# Altium schematic sheet ADC_8CH.SchDoc: FMC_ADC
size 420 x 297 mm; Author: G.Kasprowicz; CompanyName: WUT ISE; DrawnBy: G.Kasprowicz; Organization: WUT ISE; Address1: PW ISE; Address2: Nowowiejska 15/19 00-665 Warsaw; Address3: gkasprow@gmail.com; DocumentNumber: 5; Revision: 2; SheetNumber: 5; SheetTotal: 12; ModifiedBy: -; CheckedDate: -; Title2: ADC; DivGrp: WUT ISE; Designer: G.Kasprowicz; ModifiedDate: -; ProjectName: Sensor Box
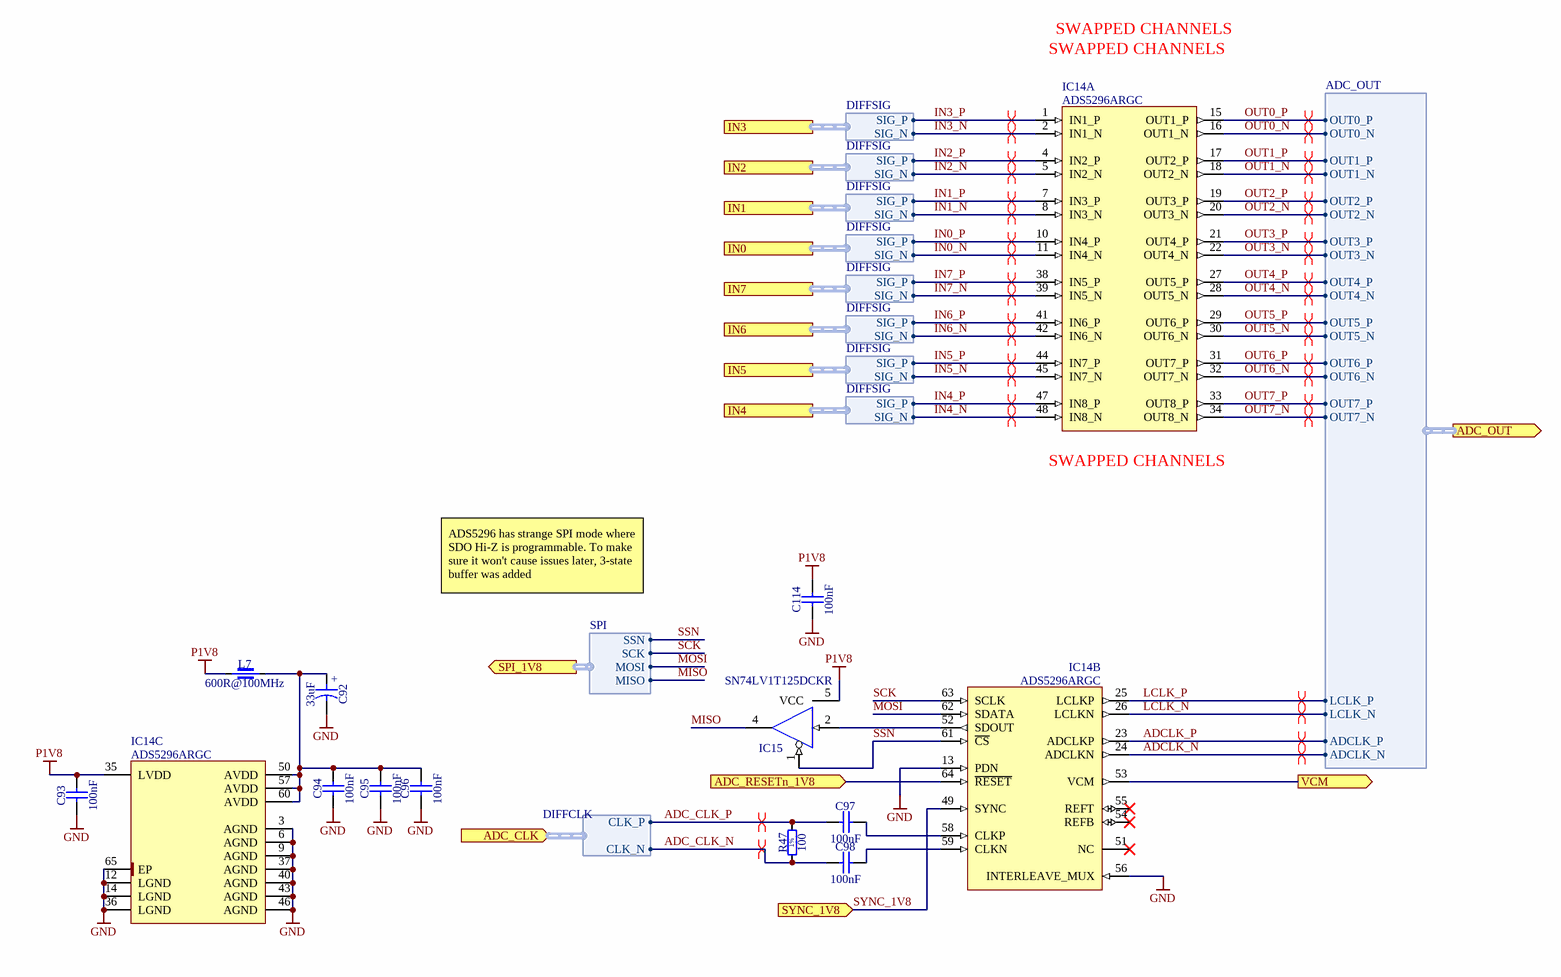
[diagram p0: ADC_8CH.SchDoc]

## Parts
C92  33uF  [CAPMP3216X180N]
C93  100nF  [CAPC0603X33N]
C94  100nF  [CAPC0603X33N]
C95  100nF  [CAPC0603X33N]
C96  100nF  [CAPC0603X33N]
C97  100nF  [CAPC0603X33N]
C98  100nF  [CAPC0603X33N]
C114  100nF  [CAPC0603X33N]
IC14  ADS5296ARGC  [QFN50P900X900X100-65N-S735]  (parts A,B,C of 3)
IC15  SN74LV1T125DCKR  [SOT65P210X110-5N]
L7  600R@100MHz  [INDC1005X55N]
R47  100  [RESC0603X28N]

## Ports
ADC_CLK (in, harness DIFFCLK), ADC_OUT (out, harness ADC_OUT), ADC_RESETn_1V8 (in), IN0 (harness DIFFSIG), IN1 (harness DIFFSIG), IN2 (harness DIFFSIG), IN3 (harness DIFFSIG), IN4 (harness DIFFSIG), IN5 (harness DIFFSIG), IN6 (harness DIFFSIG), IN7 (harness DIFFSIG), SPI_1V8 (out, harness SPI), SYNC_1V8 (in), VCM (out)

## Harnesses
ADC_OUT: LCLK_P, LCLK_N, ADCLK_P, ADCLK_N, OUT1_N, OUT2_N, OUT3_N, OUT4_N, OUT5_N, OUT1_P, OUT2_P, OUT3_P, OUT4_P, OUT5_P, OUT0_P, OUT0_N, OUT6_P, OUT6_N, OUT7_P, OUT7_N
SPI: MISO, MOSI, SCK, SSN
DIFFCLK: CLK_P, CLK_N
DIFFSIG: SIG_P, SIG_N

## Nets
GND: C92.2 C93.1 C94.1 C95.1 C96.1 C114.1 IC14.3(AGND) IC14.6(AGND) IC14.9(AGND) IC14.12(LGND) IC14.13(PDN) IC14.14(LGND) IC14.36(LGND) IC14.37(AGND) IC14.40(AGND) IC14.43(AGND) IC14.46(AGND) IC14.56(INTERLEAVE_MUX) IC14.65(EP) IC15.3(GND)
P1V8: C93.2 C114.2 IC14.35(LVDD) IC15.5(VCC) L7.1
ADC_CLK_N: C98.1 R47.1 ; port ADC_CLK.CLK_N
ADC_CLK_P: C97.1 R47.2 ; port ADC_CLK.CLK_P
ADC_RESETn_1V8: IC14.64(~{RESET}) ; port ADC_RESETn_1V8
ADCLK_N: IC14.24(ADCLKN) ; port ADC_OUT.ADCLK_N
ADCLK_P: IC14.23(ADCLKP) ; port ADC_OUT.ADCLK_P
IN0_N: IC14.11(IN4_N) ; port IN0.SIG_N
IN0_P: IC14.10(IN4_P) ; port IN0.SIG_P
IN1_N: IC14.8(IN3_N) ; port IN1.SIG_N
IN1_P: IC14.7(IN3_P) ; port IN1.SIG_P
IN2_N: IC14.5(IN2_N) ; port IN2.SIG_N
IN2_P: IC14.4(IN2_P) ; port IN2.SIG_P
IN3_N: IC14.2(IN1_N) ; port IN3.SIG_N
IN3_P: IC14.1(IN1_P) ; port IN3.SIG_P
IN4_N: IC14.48(IN8_N) ; port IN4.SIG_N
IN4_P: IC14.47(IN8_P) ; port IN4.SIG_P
IN5_N: IC14.45(IN7_N) ; port IN5.SIG_N
IN5_P: IC14.44(IN7_P) ; port IN5.SIG_P
IN6_N: IC14.42(IN6_N) ; port IN6.SIG_N
IN6_P: IC14.41(IN6_P) ; port IN6.SIG_P
IN7_N: IC14.39(IN5_N) ; port IN7.SIG_N
IN7_P: IC14.38(IN5_P) ; port IN7.SIG_P
LCLK_N: IC14.26(LCLKN) ; port ADC_OUT.LCLK_N
LCLK_P: IC14.25(LCLKP) ; port ADC_OUT.LCLK_P
MISO: IC15.4(OUT) ; port SPI_1V8.MISO
MOSI: IC14.62(SDATA) ; port SPI_1V8.MOSI
OUT0_N: IC14.16(OUT1_N) ; port ADC_OUT.OUT0_N
OUT0_P: IC14.15(OUT1_P) ; port ADC_OUT.OUT0_P
OUT1_N: IC14.18(OUT2_N) ; port ADC_OUT.OUT1_N
OUT1_P: IC14.17(OUT2_P) ; port ADC_OUT.OUT1_P
OUT2_N: IC14.20(OUT3_N) ; port ADC_OUT.OUT2_N
OUT2_P: IC14.19(OUT3_P) ; port ADC_OUT.OUT2_P
OUT3_N: IC14.22(OUT4_N) ; port ADC_OUT.OUT3_N
OUT3_P: IC14.21(OUT4_P) ; port ADC_OUT.OUT3_P
OUT4_N: IC14.28(OUT5_N) ; port ADC_OUT.OUT4_N
OUT4_P: IC14.27(OUT5_P) ; port ADC_OUT.OUT4_P
OUT5_N: IC14.30(OUT6_N) ; port ADC_OUT.OUT5_N
OUT5_P: IC14.29(OUT6_P) ; port ADC_OUT.OUT5_P
OUT6_N: IC14.32(OUT7_N) ; port ADC_OUT.OUT6_N
OUT6_P: IC14.31(OUT7_P) ; port ADC_OUT.OUT6_P
OUT7_N: IC14.34(OUT8_N) ; port ADC_OUT.OUT7_N
OUT7_P: IC14.33(OUT8_P) ; port ADC_OUT.OUT7_P
SCK: IC14.63(SCLK) ; port SPI_1V8.SCK
SSN: IC14.61(~{CS}) IC15.1(~{G}) ; port SPI_1V8.SSN
SYNC_1V8: IC14.49(SYNC) ; port SYNC_1V8
VCM: IC14.53(VCM) ; port VCM
NetC92_1: C92.1 C94.2 C95.2 C96.2 IC14.50(AVDD) IC14.57(AVDD) IC14.60(AVDD) L7.2
NetC97_2: C97.2 IC14.58(CLKP)
NetC98_2: C98.2 IC14.59(CLKN)
NetIC14_52: IC14.52(SDOUT) IC15.2(IN)

Not connected (* = marked no-connect by the designer): IC14 51(NC)* 54(REFB)* 55(REFT)*

## Layout directives
differential pair: ADC_CLK_N, ADC_CLK_P, ADCLK_N, ADCLK_P, IN0_N, IN0_P, IN1_N, IN1_P, IN2_N, IN2_P, IN3_N, IN3_P, IN4_N, IN4_P, IN5_N, IN5_P, IN6_N, IN6_P, IN7_N, IN7_P, LCLK_N, LCLK_P, OUT0_N, OUT0_P, OUT1_N, OUT1_P, OUT2_N, OUT2_P, OUT3_N, OUT3_P, OUT4_N, OUT4_P, OUT5_N, OUT5_P, OUT6_N, OUT6_P, OUT7_N, OUT7_P

## Notes on the sheet
- SWAPPED CHANNELS
- (near IC14) SWAPPED CHANNELS
- ADS5296 has strange SPI mode where SDO Hi-Z is programmable. To make sure it won't cause issues later, 3-state buffer was added
- Project/Equipment
- Document
- Designer
- Drawn by
- Check.by
- Copyright WUT ISE 2018.
  This documentation describes Open Hardware and is licensed under the CERN OHL v.1.1. You may redistribute and modify this documentation under the terms of the CERN OHL v.1.1. (http://ohwr.org/CERNOHL). This documentation is distributed WITHOUT ANY EXPRESS OR IMPLIED WARRANTY, INCLUDING OF MERCHANTABILITY, SATISFACTORY QUALITY AND FITNESS FOR A PARTICULAR PURPOSE. Please see the CERN OHL v.1.1 for applicable conditions.
- Contact
- File
- Last Mod.
- Print Date
- Sheet
- Size
- A3
- of
- Rev
- (in symbol CTE3216-18_33UF_4V_10%) +
- (in symbol R0201_100R_1%_0.05W_200PPM) 1%

## Library data of the parts
C92 = CTE3216-18_33UF_4V_10%: Polarised capacitor; Part Description: Solid Tantalum Chip Capacitor; Manufacturer: GENERIC; Manufacturer1 Part Number: TAJA336K004R; Voltage: 4V; Tolerance: ±10%; Part Number: CTE3216-18_33UF_4V_10%; Component Kind: Standard; Component Type: Standard; Pin Count: 2; Value: 33uF; Status: Preferred; Manufacturer Part Number: CTE3216-18_33UF_4V_10%; Case: A; Mounted: Yes; Socket: No; SMD: Yes; Sense: No; Manufacturer1 Example: AVX; Manufacturer1 ComponentHeight: 1.8mm; HelpURL: \\cern.ch\dfs\Applications\Altium\Datasheets\CTE_AVX_TAJ.pdf; Author: CERN DEM JLC; CreateDate: 03.12.2007; LatestRevisionDate: 03.12.2007
C93-C98 C114 = CC0201_100NF_6.3V_10%_X5R: Non-polarised capacitor; Part Description: SMD Multilayer Chip Ceramic Capacitor; Manufacturer: GENERIC; Manufacturer1 Part Number: 02016D104KAT2A; Voltage: 6.3V; TC: X5R; Tolerance: ±10%; Part Number: CC0201_100NF_6.3V_10%_X5R; Component Kind: Standard; Component Type: Standard; Pin Count: 2; Value: 100nF; Status: Not Recommended; Manufacturer Part Number: CC0201_100NF_6.3V_10%_X5R; Case: 0201; Mounted: Yes; Socket: No; SMD: Yes; Sense: No; Manufacturer1 Example: AVX; Manufacturer1 ComponentHeight: 0.33mm; HelpURL: \\cern.ch\dfs\Applications\Altium\Datasheets\CC0201_X5R_AVX.pdf; Author: CERN DEM JLC; CreateDate: 03.12.2007; LatestRevisionDate: 03.12.2007
IC14 = ADS5296ARGC: 10-Bit, 200-MSPS, 4-Channel and 12-Bit, 80-MSPS, 8-Channel ADC; Manufacturer: TEXAS INSTRUMENTS; PressFit: No; Bonding: No; Part Number: ADS5296ARGC; Component Kind: Standard; Component Type: Standard; Device: ADS5296ARGC; PackageDescription: QFN, 0.50mm Pitch, Square; 64 Pin, 9.00mm L X 9.00mm W X 1.00mm H Body (7.35 X 7.35mm Thermal Tab), IPC Medium Density; Part Description: 10-Bit, 200-MSPS, 4-Channel and 12-Bit, 80-MSPS, 8-Channel ADC; Manufacturer Part Number: ADS5296ARGC; Pin Count: 65; Case: QFN64; Mounted: Yes; Socket: No; SMD: Yes; Sense: No; ComponentHeight: 1mm; Author: CERN DEM MR; HelpURL: \\cern.ch\dfs\Applications\Altium\Datasheets\ADS5296ARGC.pdf; CreateDate: 23.04.2019; LatestRevisionDate: 23.04.2019
IC15 = SN74LV1T125DCKR: Single Power Supply Single Buffer Gate with 3-State Output CMOS Logic Level Shifter; Manufacturer: TEXAS INSTRUMENTS; PressFit: No; Bonding: No; Part Number: SN74LV1T125DCKR; Component Kind: Standard; Component Type: Standard; Device: SN74LV1T125DCKR; PackageDescription: SOT353, SC70-5, SOT, 0.65mm Pitch, 5 pin, 1.25mm W X 2.00mm L X 1.10mm H, IPC Medium Density; Part Description: Single Power Supply Single Buffer Gate with 3-State Output CMOS Logic Level Shifter; Manufacturer Part Number: SN74LV1T125DCKR; Pin Count: 5; Case: SOT353; Mounted: Yes; Socket: No; SMD: Yes; Sense: No; ComponentHeight: 1.1mm; Author: CERN DEM JLC; HelpURL: \\cern.ch\dfs\Applications\Altium\Datasheets\SN74LV1T125DCKR.pdf; CreateDate: 13.06.2018; LatestRevisionDate: 13.06.2018
L7 = IND0402_MURATA_BLM15HD601SN1: Part Description: SMD EMIFIL Suppression Chip Ferrite Bead; Manufacturer: MURATA; Manufacturer Part Number: BLM15HD601SN1D; Power: 300mA; Resistance: 0.85R; Tolerance: ±25%; Part Number: IND0402_MURATA_BLM15HD601SN1; Component Kind: Standard; Component Type: Standard; Pin Count: 2; Value: 600R@100MHz; Status: None; Case: 0402; Mounted: Yes; Socket: No; SMD: Yes; Sense: No; ComponentHeight: 0.55mm; HelpURL: \\cern.ch\dfs\Applications\Altium\Datasheets\IND0402_MURATA_BLM15H.pdf; Author: CERN DEM JLC; CreateDate: 28.02.2012; LatestRevisionDate: 25.10.2018
R47 = R0201_100R_1%_0.05W_200PPM: Resistor - 1%; Part Description: Thick Film Chip Resistor; Manufacturer: GENERIC; Manufacturer1 Part Number: CRCW0201100RFNED; Power: 0.05W; TC: ±200ppm/°C; PressFit: No; Part Number: R0201_100R_1%_0.05W_200PPM; Component Kind: Standard; Component Type: Standard; Pin Count: 2; Value: 100; Status: Not Recommended; Tolerance: ±1%; Manufacturer Part Number: R0201_100R_1%_0.05W_200PPM; Case: 0201; Mounted: Yes; Sense: No; Socket: No; SMD: Yes; Manufacturer1 Example: VISHAY; Manufacturer1 ComponentHeight: 0.27mm; HelpURL: \\cern.ch\dfs\Applications\Altium\Datasheets\R0201_VISHAY_CRCW0201 e3.pdf; Author: CERN DEM JLC; CreateDate: 13.11.2014; LatestRevisionDate: 13.11.2014